# EAGLE design two_pieceboard_2 (EAGLE 7.6.0)
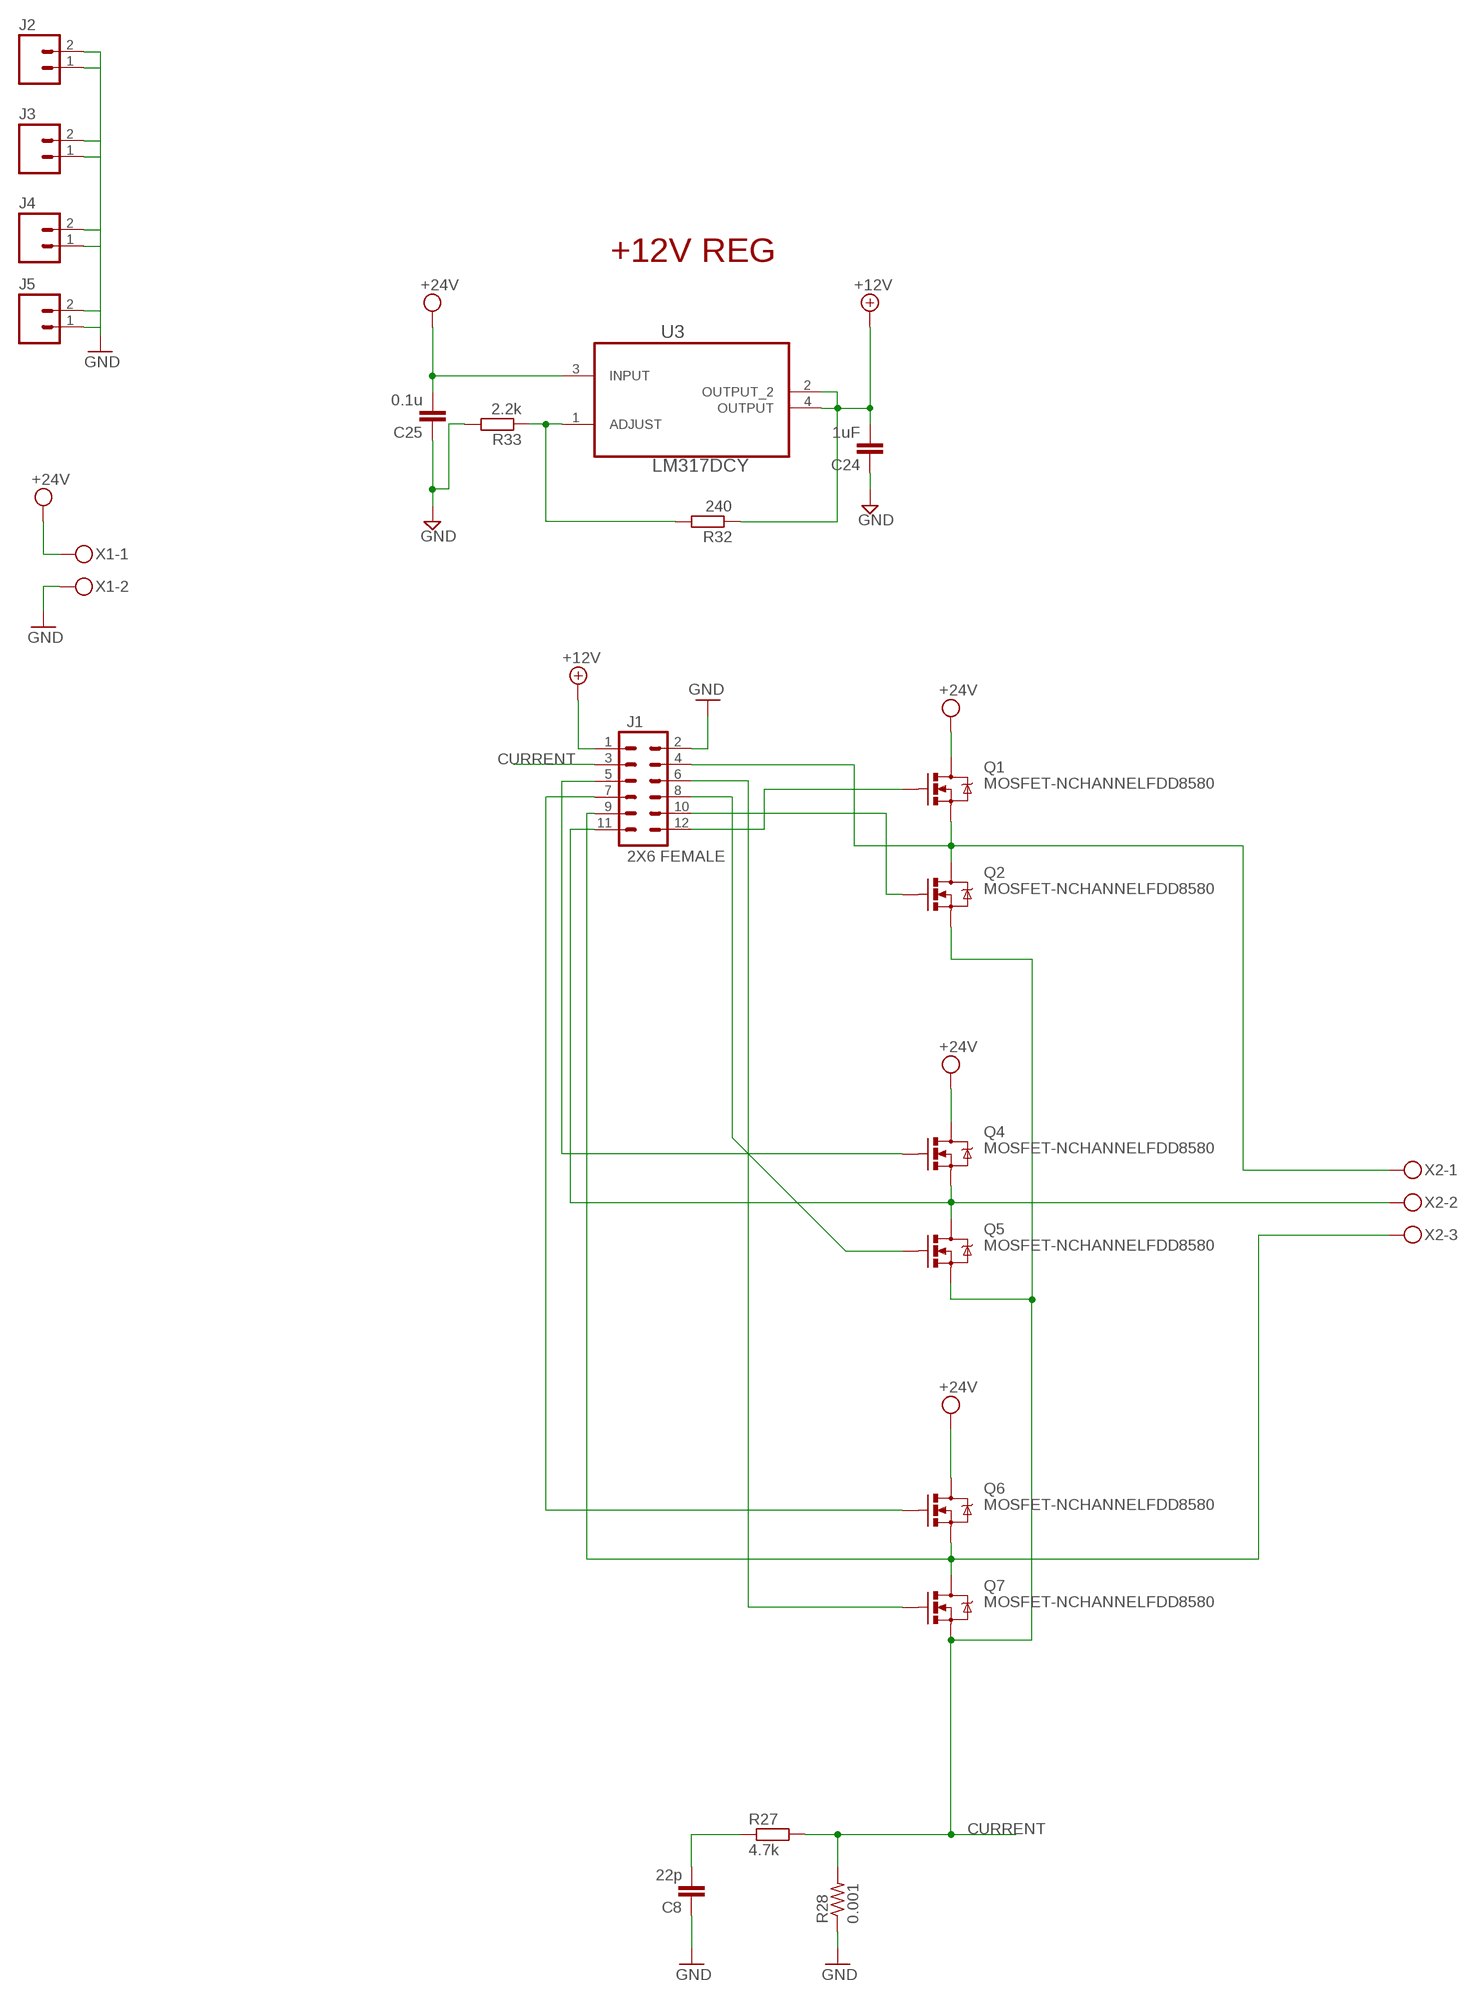
[diagram p0: schematic, sheet 1]

## Parts
C8  22p  C-EUC1206  [C1206]
C24  1uF  C-EUC1206  [C1206]
C25  0.1u  C-EUC1206  [C1206]
J1  2X6 FEMALE  M06X2PTH_FEMALE  [2X6]
J2  M02PTH  [1X02]
J3  M02PTH  [1X02]
J4  M02PTH  [1X02]
J5  M02PTH  [1X02]
Q1  MOSFET-NCHANNELFDD8580  [DPAK]
Q2  MOSFET-NCHANNELFDD8580  [DPAK]
Q4  MOSFET-NCHANNELFDD8580  [DPAK]
Q5  MOSFET-NCHANNELFDD8580  [DPAK]
Q6  MOSFET-NCHANNELFDD8580  [DPAK]
Q7  MOSFET-NCHANNELFDD8580  [DPAK]
R27  4.7k  R-EU_R1206  [R1206]
R28  0.001  R-US_R2512  [R2512]
R32  240  R-EU_R1206  [R1206]
R33  2.2k  R-EU_R1206  [R1206]
U3  LM317DCY  [SOT230P700X180-4N]
X1  MKDSN1,5/2-5,08  [MKDSN1,5/2-5,08]
X2  MKDSN1,5/3-5,08  [MKDSN1,5/3-5,08]

## Nets
+12V: C24.2 J1.1 R32.1 U3.2(OUTPUT_2) U3.4(OUTPUT)
BLDC1: J1.4 Q1.3(S) Q2.4(D) X2.1
BLDC2: J1.11 Q4.3(S) Q5.4(D) X2.2
BLDC3: J1.9 Q6.3(S) Q7.4(D) X2.3
CURRENT: J1.3 Q2.3(S) Q5.3(S) Q7.3(S) R27.2 R28.2
GND [gnd]: C8.1 C24.1 C25.1 J1.2 J2.1 J2.2 J3.1 J3.2 J4.1 J4.2 J5.1 J5.2 R28.1 R33.2 X1.2
N$1: J1.12 Q1.1(G)
N$2: J1.10 Q2.1(G)
N$5: R32.2 R33.1 U3.1(ADJUST)
N$6: J1.8 Q5.1(G)
N$7: J1.7 Q6.1(G)
N$8: J1.6 Q7.1(G)
N$9: C8.2 R27.1
N$16: J1.5 Q4.1(G)
VCC: C25.2 Q1.4(D) Q4.4(D) Q6.4(D) U3.3(INPUT) X1.1 ; supply symbol labelled +24V

## Notes on the sheet
- +12V REG

## Library data of the parts
C8 C24 C25 = SmartPrj:C-EU: CAPACITOR, European symbol
J1 = SparkFun-Connectors:M06X2; PROD_ID: CONN-12423
J2-J5 = SparkFun-Connectors:M02: Standard 2-pin 0.1" header. Use with - straight break away headers ( PRT-00116) - right angle break away headers (PRT-00553) - swiss pins (PRT-00743) - machine pins (PRT-00117) - female headers (PRT-00115) Molex polarized connector foot print use with: PRT-08233 with associated crimp pins and housings. 2.54_SCREWTERM for use with PRT-10571. 3.5mm Screw Terminal footprints for PRT-08084 5mm Screw Terminal footprints for use with PRT-08432
Q1 Q2 Q4-Q7 = SparkFun:MOSFET-NCHANNEL
R27 R32 R33 = SmartPrj:R-EU_: RESISTOR, European symbol
R28 = resistor:R-US_: RESISTOR, American symbol
U3 = Texas Instruments_By_element14_Batch_1:LM317DCY: IC ADJ LINEAR REG 1.25V TO 37V; MPN: LM317DCY; OC_FARNELL: 1626539; OC_NEWARK: 75C0809; PACKAGE: SOT-223-3; SUPPLIER: TEXAS INSTRUMENTS
X1 = con-phoenix-508:MKDSN1,5/2-5,08: MKDSN 1,5/ 2-5,08 Printklemme Nennstrom: 13,5 A Nennspannung: 250 V Rastermaß: 5,08 mm Polzahl: 2 Anschlussart: Schraubanschluss Montage: Löten Anschlussrichtung Leiter/Platine: 0 ° Artikelnummer: 1729128 Source: http://eshop.phoenixcontact.com .. 1729128.pdf; MPN: MKDSN 1,5/2-5.08; OC_FARNELL: 1792903; OC_NEWARK: 30M2397
X2 = con-phoenix-508:MKDSN1,5/3-5,08: MKDSN 1,5/ 3-5,08 Printklemme Nennstrom: 13,5 A Nennspannung: 250 V Rastermaß: 5,08 mm Polzahl: 3 Anschlussart: Schraubanschluss Montage: Löten Anschlussrichtung Leiter/Platine: 0 ° Artikelnummer: 1729131 Source: http://eshop.phoenixcontact.com .. 1729131.pdf; MPN: SMKDSN1,5/3-5,08; OC_FARNELL: 1792904; OC_NEWARK: 70R0299

## Net classes
0 default: width 0.254 mm, drill 0.61 mm, clearance 0.203 mm
2 gnd: width 0.254 mm, drill 0.61 mm, clearance 0.254 mm
3 usbvcc: width 0.254 mm, drill 0.61 mm, clearance 0.254 mm

## Board
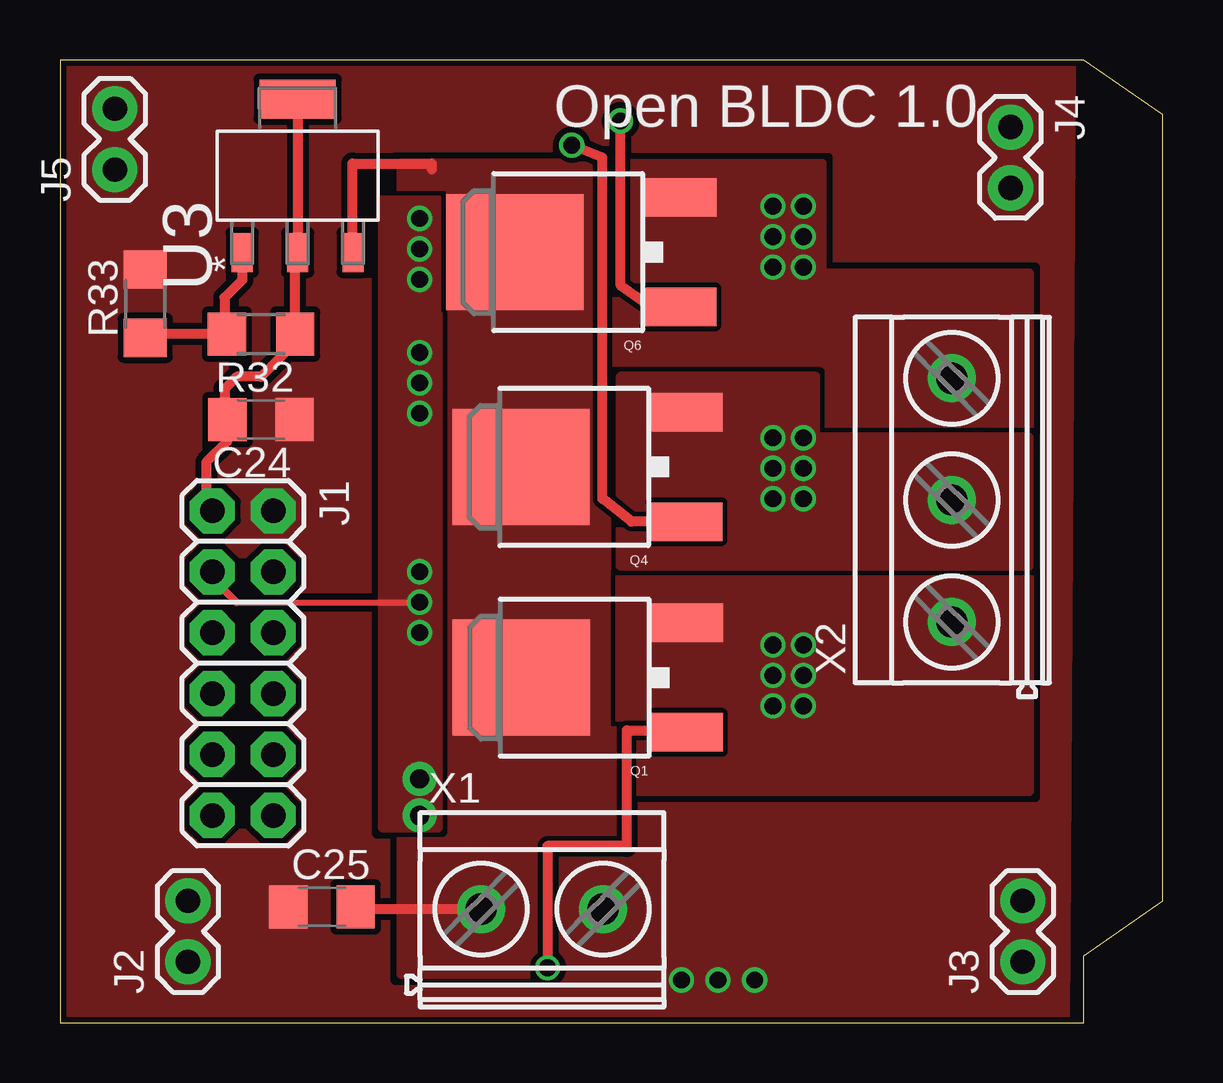
[diagram p1: board, top side]
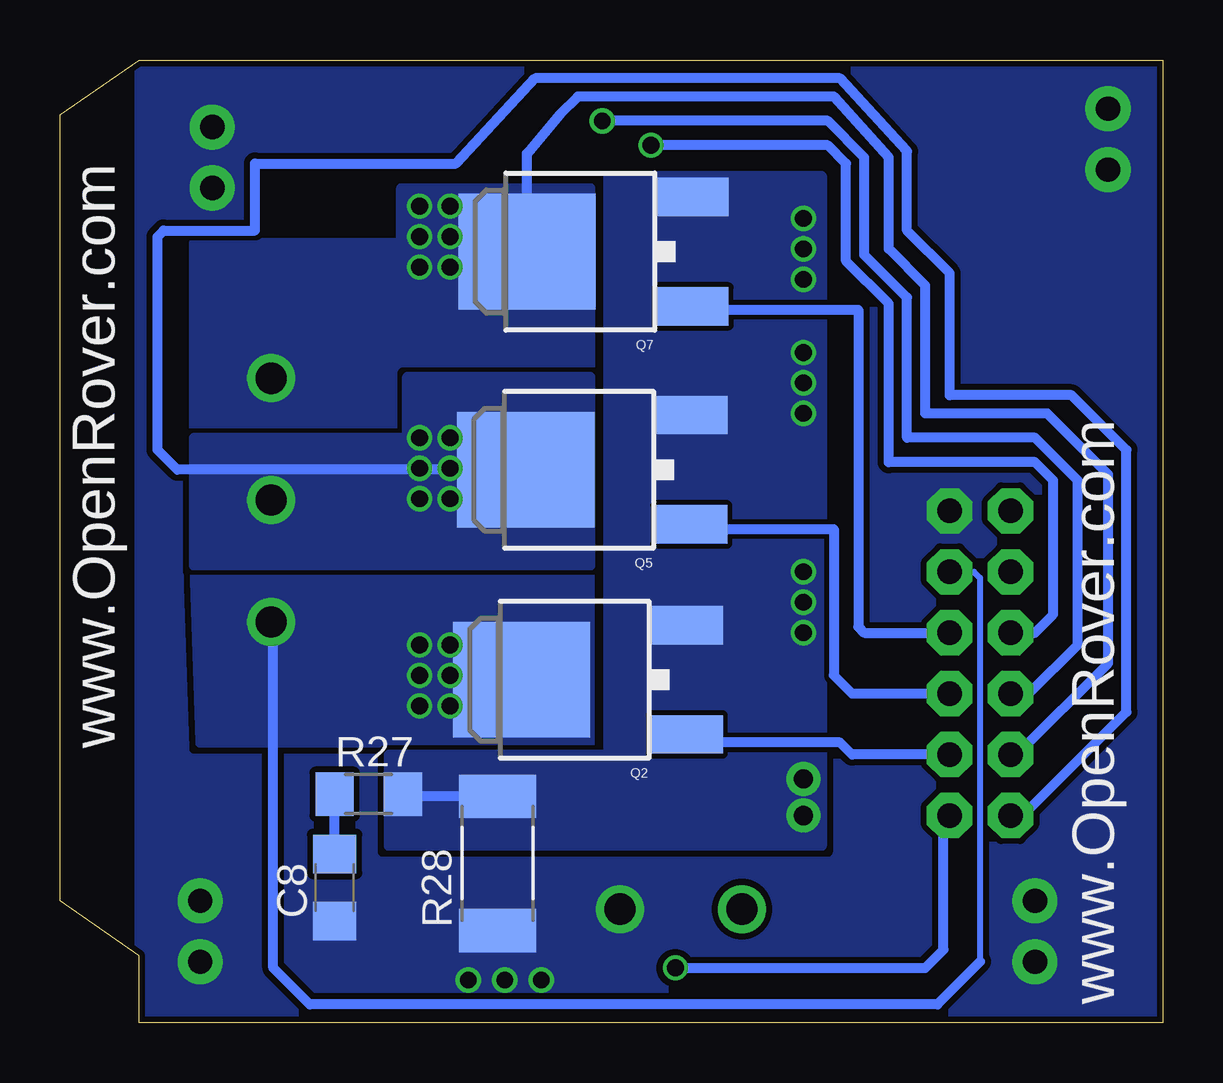
[diagram p2: board, bottom side, seen from below]

Size 45.97 x 40.13 mm. Coordinates in mm from the lower left corner, seen from the top.
Outline: 0,0 42.67,0 42.67,2.79 45.97,5.08 45.97,37.85 42.67,40.13 0,40.13 0,0
Copper layers (1*16): Top 0.035mm / dielectric 1.5mm / Bottom 0.035mm
Design rules "dirt_cheap_dirty_boards.v1": minimum track width 5mil, minimum drill 12mil, track to track 5mil, track to pad 5mil, pad to pad 5mil, via to via 5mil, smd to smd 0mil, copper to edge 10mil, drill to drill 10mil, minimum pad ring 10mil, minimum via ring 6mil, stop-mask expansion 2mil, vias tented up to drill 25mil, thermal gap 10mil

### Footprints (pad centres in the part's own frame; a part is rotated, then mirrored left to right if it is on the bottom)
C1206 = smd 1.6 x 1.8: 1 -1.4,0; 2 1.4,0
2X6 = drill 1.016 pad 1.88 octagon: 1 0,0; 2 0,2.54; 3 2.54,0; 4 2.54,2.54; 5 5.08,0; 6 5.08,2.54; 7 7.62,0; 8 7.62,2.54; 9 10.16,0; 10 10.16,2.54; 11 12.7,0; 12 12.7,2.54
1X02 = drill 1.016 pad 1.88: 1 0,0; 2 2.54,0
DPAK = smd 1.6 x 3: 1 -2.28,-5.31; 3 2.28,-5.31 | smd 4.826 x 5.715: 4 0,1.588
R1206 = smd 1.6 x 1.803: 1 -1.422,0; 2 1.422,0
R2512 = smd 1.8 x 3.2: 1 -2.8,0; 2 2.8,0
SOT230P700X180-4N = smd 1.626 x 0.889: 1 -3.2,2.311; 2 -3.2,0; 3 -3.2,-2.311 | smd 1.626 x 3.175: 4 3.2,0
MKDSN1,5/2-5,08 = drill 1.3 pad 2: 1 -2.561,0.025; 2 2.519,0.025
MKDSN1,5/3-5,08 = drill 1.3 pad 2: 1 -7.641,0.025; 2 -2.561,0.025; 3 2.519,0.025

### Placement (x,y rotation side)
C8  34.53,5.64 90 bottom
C24  8.38,25.15 180 top
C25  10.92,4.83 0 top
J1  6.35,21.34 270 top
J2  5.33,2.54 90 top
J3  40.13,2.54 90 top
J4  39.62,37.34 270 top
J5  2.29,35.56 90 top
Q1  20.82,14.39 90 top
Q2  25.15,14.3 90 bottom
Q4  20.8,23.17 90 top
Q5  24.97,23.05 90 bottom
Q6  20.55,32.12 90 top
Q7  24.92,32.14 90 bottom
R27  33.1,9.53 0 bottom
R28  27.73,6.64 90 bottom
R32  8.38,28.7 180 top
R33  3.56,29.97 90 top
U3  9.91,35.31 90 top
X1  20.11,4.71 0 top
X2  37.2,24.35 90 top

### Tracks (layer width: path | path; a pad name or v marks a point on that pad's centre or on a via)
+12V
  Top 0.406: U3.4 U3.2 9.8,32 R32.1 9.8,28.35 8.38,26.92 7.37,26.92 6.86,26.42 6.86,25.27 C24.2 6.98,24.25 6.1,23.37 6.1,21.59 J1.1
BLDC1  (via drill 0.7)
  Bottom 0.254: J1.4 7.87,18.8 7.62,18.54 7.62,2.54
  Bottom 0.406: 7.62,2.54 9.4,0.76 35.56,0.76 37.08,2.29 37.08,16.61 X2.1
  other vias: 29.72,13.21 29.72,15.75 29.72,14.48 30.99,13.21 30.99,14.48 30.99,15.75
  pour Bottom (rank 3, no thermals): 23.88,19.05 40.39,19.05 40.13,11.68 23.88,11.68
  pour Top (rank 2, no thermals): 40.39,9.65 23.37,9.65 23.37,19.05 40.39,19.05
BLDC2  (via drill 0.7)
  Bottom 0.406: Q5.4 41.08,23.05 41.91,23.88 41.91,32.77 41.66,33.02 37.85,33.02 37.85,35.81 29.46,35.81 26.16,39.37 13.46,39.37 10.67,36.32 10.67,33.02 8.89,31.24 8.89,26.16 3.81,26.16 1.52,23.88 1.52,12.95 5.84,8.64 J1.11
  other vias: 29.72,23.11 29.72,24.38 30.99,23.11 30.99,24.38 29.72,21.84 30.99,21.84
  pour Bottom (rank 2, no thermals): 23.88,26.92 23.88,19.05 40.39,19.05 40.39,24.38 31.5,24.38 31.5,26.92
  pour Top (no thermals): 23.37,26.92 23.37,19.05 40.39,19.05 40.39,24.38 31.5,24.38 31.5,26.92
BLDC3  (via drill 0.7)
  Bottom 0.406: Q7.4 26.51,36.23 25.15,37.85 24.38,38.61 13.72,38.61 11.43,36.07 11.43,32.26 9.91,30.73 9.91,25.4 4.83,25.4 2.29,22.86 2.29,14.99 6.1,11.18 J1.9
  other vias: 30.99,34.04 30.99,32.77 30.99,31.5 29.72,34.04 29.72,32.77 29.72,31.5
  pour Bottom (rank 3, no thermals): 23.88,26.92 31.5,26.92 31.5,24.38 40.39,24.38 40.39,32.51 31.75,32.51 31.75,34.8 23.88,34.8
  pour Top (rank 2, no thermals): 23.11,35.81 31.75,35.81 31.75,31.24 40.39,31.24 40.39,24.64 31.5,24.64 31.5,26.92 23.11,26.92
CURRENT  (via drill 0.7, 0.8 pad 1.42)
  Top 0.254: 7.37,17.53 v14.99,17.53
  Top 0.305: 6.35,18.54 7.37,17.53
  Top 0.406: J1.3 6.35,18.54
  Bottom 0.406: R28.2 31.59,9.44 R27.2
  other vias: 14.99,33.53 14.99,32.26 14.99,30.99 14.99,27.94 14.99,26.67 14.99,25.4 14.99,18.8 14.99,16.26 14.99,8.64 14.99,10.16
  pour Bottom (no thermals): 23.11,35.31 14.22,35.31 14.22,7.37 32.26,7.37 32.26,11.18 23.11,11.18
  pour Top (no thermals): 15.75,34.29 15.75,8.13 13.46,8.13 13.46,34.29
GND  (via drill 0.7)
  other vias: 25.91,1.78 27.43,1.78 28.96,1.78
  pour Top (rank 6, no thermals): 0,40.13 0,0 41.91,0 42.16,40.13
  pour Bottom (rank 6, no thermals): 0.25,40.13 42.67,40.13 42.67,0 0.25,0
N$1  (via drill 0.7)
  Top 0.406: Q1.1 25.4,12.11 | 25.4,12.11 24.89,12.11 | v20.32,2.29 20.32,7.37 23.62,7.37 23.62,12.19 25.31,12.19 25.4,12.11
  Bottom 0.406: v20.32,2.29 9.91,2.29 9.14,3.05 9.14,8.38 J1.12
N$2
  Bottom 0.406: Q2.1 19.51,11.68 13.46,11.68 12.95,11.18 J1.10
N$5
  Top 0.406: U3.1 7.59,30.96 6.86,30.23 6.86,28.8 R32.2 3.71,28.7 R33.1
N$6
  Bottom 0.406: Q5.1 19.46,20.57 13.72,20.57 13.72,14.48 12.95,13.72 J1.8
N$7  (via drill 0.7)
  Top 0.406: Q6.1 24.64,29.84 23.37,30.73 v23.37,37.59
  Bottom 0.406: J1.7 5.59,13.72 3.56,15.75 3.56,22.61 5.33,24.38 10.67,24.38 10.67,30.23 12.45,32 12.45,36.07 13.97,37.59 v23.37,37.59
N$8
  Bottom 0.406: Q7.1 18.8,29.86 18.8,29.72 12.7,29.72 12.7,16.51 12.45,16.26 J1.6
N$9
  Bottom 0.406: C8.2 R27.1
N$16  (via drill 0.7)
  Top 0.406: Q4.1 23.82,20.89 22.61,21.84 22.61,36.07 v21.34,36.58
  Bottom 0.406: J1.5 5.33,16.26 4.57,17.02 4.57,22.61 5.33,23.37 11.43,23.37 11.43,29.97 13.21,31.75 13.21,35.81 13.97,36.58 v21.34,36.58
VCC
  Top 0.406: 18.94,32.11 Q6.4 | X1.1 12.41,4.73 C25.2 | U3.3 12.19,32.11 12.19,35.81 15.49,35.81 15.49,35.56
  pour Top (rank 4, no thermals): 23.11,35.81 14.22,35.81 14.22,2.03 20.07,2.03 20.07,7.62 23.11,7.62

### Text on the board
tPlace: Open BLDC 1.0
bPlace: www.OpenRover.com | www.OpenRover.com